# EAGLE design Yung_Chicklet (EAGLE 9.6.0)
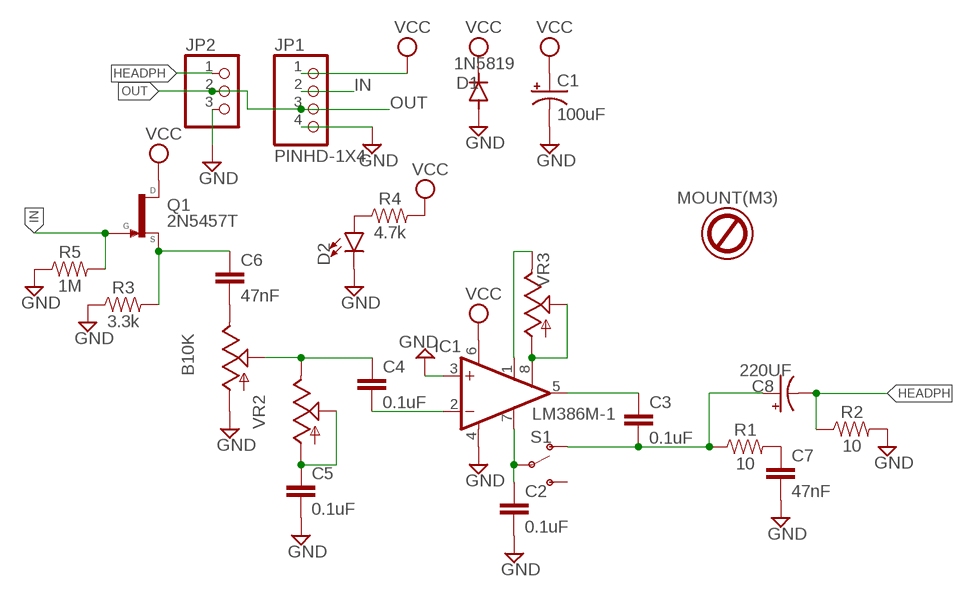
[diagram p0: schematic, sheet 1]

## Parts
B10K  9MM_SNAP-IN_POT_  [9MM_SNAP-IN_POT]
C1  100uF  CAP_SMD+THRUPAN_B  [PAN_B_SMD+THRU]
C2  0.1uF  0.1UF-0603-25V-(+80/-20%)  [0603]
C3  0.1uF  0.1UF-0603-25V-(+80/-20%)  [0603]
C4  0.1uF  0.1UF-0603-25V-(+80/-20%)  [0603]
C5  0.1uF  0.1UF-0603-25V-(+80/-20%)  [0603]
C6  47nF  47NF-0603-25V-5%  [0603]
C7  47nF  47NF-0603-25V-5%  [0603]
C8  220UF  CAP_SMD+THRUPAN_B  [PAN_B_SMD+THRU]
D1  1N5819  DIODE-SOD123  [SOD123]
D2  LED1206  [LED-1206]
IC1  LM386M-1  [SO08]
JP1  PINHD-1X4  [1X04]
JP2  PINHD-1X3  [1X03]
O2  MOUNT(M3)  [HOLE-3.5MM]
Q1  2N5457T  [TO92F]
R1  10  10OHM-0603-1/10W-1%  [0603]
R2  10  10OHM-0603-1/10W-1%  [0603]
R3  3.3k  3.3KOHM-0603-1/10W-1%  [0603]
R4  4.7k  4.7KOHM-0603-1/10W-1%  [0603]
R5  1M  1MOHM-0603-1/4W-5%  [0603]
S1  SWITCH-SPDT-PTH-11.6X4.0MM-LOCK  [SWITCH_SPDT_PTH_11.6X4.0MM_LOCK]
VR2  9MM_SNAP-IN_POT_  [9MM_SNAP-IN_POT]
VR3  9MM_SNAP-IN_POT_  [9MM_SNAP-IN_POT]

## Nets
GND: B10K.1(A) C1.- C1.--(-) C2.2 C5.2 C7.2 D1.A D2.C IC1.3(+IN) IC1.4(GND) JP1.4 JP2.3 R2.2 R3.1 R5.1
HEADPH: C8.- C8.--(-) JP2.1 R2.1
IN: JP1.2 Q1.1(G) R5.2
N$1: D2.A R4.1
N$2: C6.1 Q1.2(S) R3.2
N$3: B10K.3(E) C6.2
N$4: B10K.2(S) C4.1 VR2.3(E)
N$5: C5.1 VR2.1(A) VR2.2(S)
N$6: C4.2 IC1.2(-IN)
N$7: IC1.8(GAIN) VR3.1(A) VR3.2(S)
N$8: IC1.1(GAIN) VR3.3(E)
N$9: C3.1 IC1.5(OUT)
N$10: C2.1 IC1.7(BYPASS) S1.2(P)
N$11: C3.2 C8.+ C8.++(+) R1.1 S1.1(O)
N$12: C7.1 R1.2
OUT: JP1.3 JP2.2
VCC: C1.+ C1.++(+) D1.C IC1.6(VS) JP1.1 Q1.3(D) R4.2
Unconnected: O2.MNT S1.3(S)

## Library data of the parts
B10K VR2 VR3 = MusicThingModular:9MM_SNAP-IN_POT: 9mm vertical snap-in pot, Alpha / Panasonic style
C1 C8 = MusicThingModular:CAP_SMD+THRU
C2-C5 = SparkFun-Capacitors:0.1UF: 0.1µF ceramic capacitors A capacitor is a passive two-terminal electrical component used to store electrical energy temporarily in an electric field.; PROD_ID: CAP-00810
C6 C7 = SparkFun-Capacitors:47NF: 47nF ceramic capacitors A capacitor is a passive two-terminal electrical component used to store electrical energy temporarily in an electric field.; PROD_ID: CAP-08605
D1 = diode:DIODE-: DIODE
D2 = SparkFun-LED:LED: LED (Generic) Standard schematic elements and footprints for 5mm, 3mm, 1206, and 0603 sized LEDs. Generic LEDs with no color specified.
IC1 = linear:LM386?-*: Low Voltage Audio Power Amplifier Source: http://cache.national.com/ds/LM/LM386.pdf
JP1 = Connector:PINHD-1X4: PIN HEADER; CATEGORY: CONNECTOR; SUB-CATEGORY: PIN-HEADER
JP2 = pinhead:PINHD-1X3: PIN HEADER
O2 = hardware:MOUNT(?)
Q1 = transistors:2N5457: N-CHANNEL JFET
R1 R2 = SparkFun-Resistors:10OHM: 10Ω resistor A resistor is a passive two-terminal electrical component that implements electrical resistance as a circuit element. Resistors act to reduce current flow, and, at the same time, act to lower voltage levels within circuits. - Wikipedia; PROD_ID: RES-12581
R3 = SparkFun-Resistors:3.3KOHM: 3.3kΩ resistor A resistor is a passive two-terminal electrical component that implements electrical resistance as a circuit element. Resistors act to reduce current flow, and, at the same time, act to lower voltage levels within circuits. - Wikipedia; PROD_ID: RES-07851
R4 = SparkFun-Resistors:4.7KOHM: 4.7kΩ resistor A resistor is a passive two-terminal electrical component that implements electrical resistance as a circuit element. Resistors act to reduce current flow, and, at the same time, act to lower voltage levels within circuits. - Wikipedia; PROD_ID: RES-07857
R5 = SparkFun-Resistors:1MOHM: 1MΩ resistor A resistor is a passive two-terminal electrical component that implements electrical resistance as a circuit element. Resistors act to reduce current flow, and, at the same time, act to lower voltage levels within circuits. - Wikipedia; PROD_ID: RES-07868
S1 = SparkFun-Switches:SWITCH-SPDT: Single Pole, Double Throw (SPDT) Switch Single-pole, double-throw (SPDT) switch. Variant Overview SMD-AYZ0202 Surface Mount DPDT Switch <https://www.sparkfun.com/products/597> (COM-00597) Used on e.g. LilyPad Arduino USB - ATmega32U4 Board <https://www.sparkfun.com/products/12049> PTH-11.6X4.0MM SPDT Mini Power Switch <https://www.sparkfun.com/products/102> (COM-00102) Used on e.g. SparkFun Simon Says - Through-Hole Soldering Kit <https://www.sparkfun.com/products/10547> (KIT-10547) PTH-11.6X4.0MM-KIT KIT version of SPDT Mini Power Switch - Simplifies soldering by removing tStop of switch pins - only one side can be soldered. PTH-11.6X4.0MM-LOCK LOCK version of SPDT Mini Power Switch - Offset pins hold switch in place for easier soldering. SMD-RIGHT-ANGLE Surface Mount Right Angle Switch <https://www.sparkfun.com/products/10860> (COM-10860) Used on e.g. SparkFun ESP8266 Thing <https://www.sparkfun.com/products/13231>; PROD_ID: SWCH-08261; SF_SKU: COM-00102

## Board
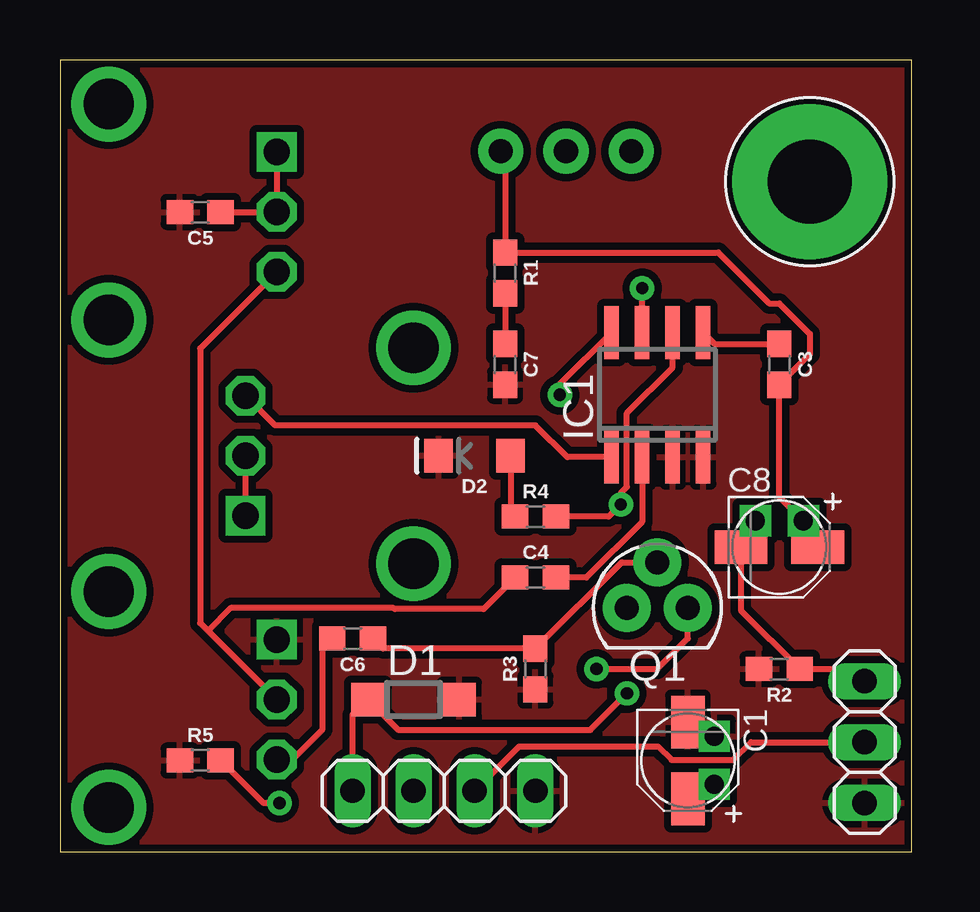
[diagram p1: board, top side]
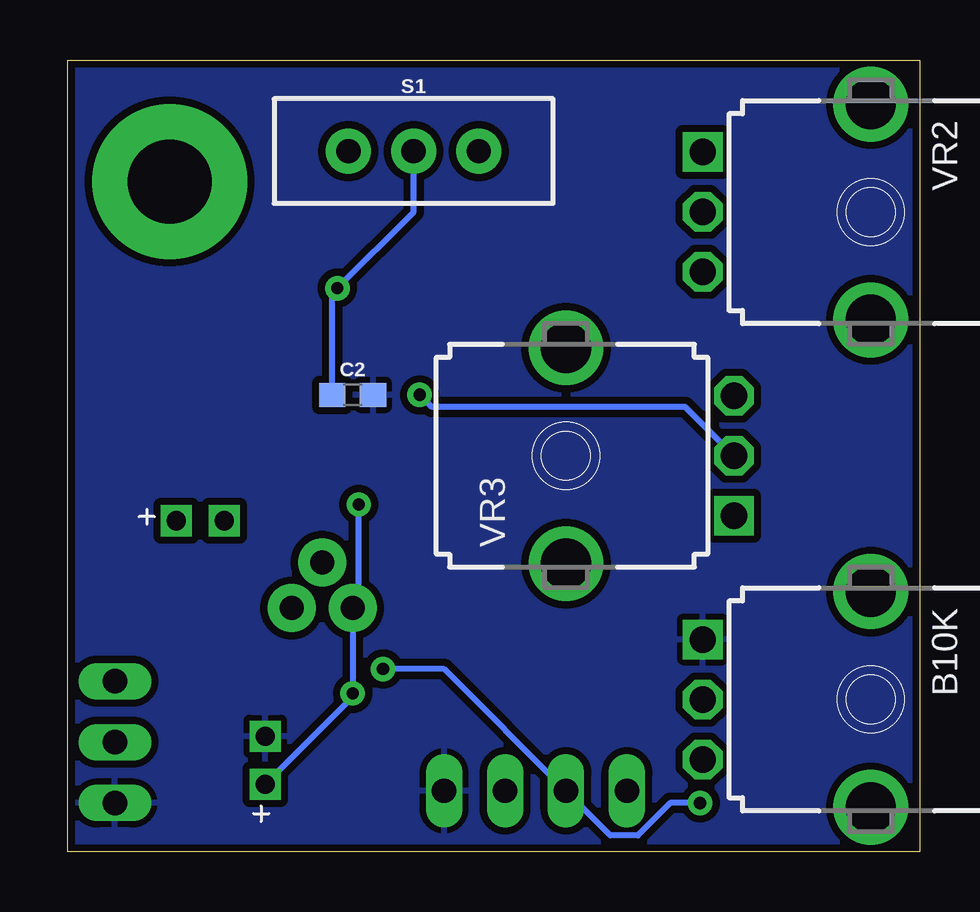
[diagram p2: board, bottom side, seen from below]

Size 35.48 x 33.01 mm. Coordinates in mm from the lower left corner, seen from the top.
Outline: 0,0 35.48,0 35.48,33.01 0,33.01 0,0
Copper layers (1*16): Top 0.035mm / dielectric 1.5mm / Bottom 0.035mm
Design rules "SparkFun-2-layer-STANDARD": minimum track width 10mil, minimum drill 20mil, track to track 10mil, track to pad 8mil, pad to pad 8mil, via to via 10mil, smd to smd 8mil, copper to edge 8mil, drill to drill 8mil, minimum pad ring 10mil, minimum via ring 10mil, stop-mask expansion 4mil, vias tented up to drill 25mil, thermal gap 10mil

### Footprints (pad centres in the part's own frame; a part is rotated, then mirrored left to right if it is on the bottom)
9MM_SNAP-IN_POT = drill 1.1 square: 1 -2.5,-7 | drill 1.1 octagon: 2 0,-7; 3 2.5,-7 | drill 2.1 pad 2.794: CHASSIS1 -4.5,0; CHASSIS2 4.5,0
PAN_B_SMD+THRU = smd 2.2 x 1.4: + 1.6,0; - -1.6,0 | drill 0.8 pad 0.9 square: ++ 1,1.1; -- -1,1.1
0603 = smd 1.1 x 1: 1 -0.85,0; 2 0.85,0
SOD123 = smd 1.4 x 1.4: A 1.9,0; C -1.9,0
LED-1206 = smd 1.2 x 1.4: A -1.5,0; C 1.5,0
SO08 = smd 0.6 x 2.2: 1 -1.905,-2.6; 2 -0.635,-2.6; 3 0.635,-2.6; 4 1.905,-2.6; 5 1.905,2.6; 6 0.635,2.6; 7 -0.635,2.6; 8 -1.905,2.6
1X04 = drill 1.016 long: 1 -3.81,0; 2 -1.27,0; 3 1.27,0; 4 3.81,0
1X03 = drill 1.016 long: 1 -2.54,0; 2 0,0; 3 2.54,0
HOLE-3.5MM = drill 3.5 pad 6.452: MNT 0,0
TO92F = drill 1 pad 2: 1 1.27,0; 2 0,1.905; 3 -1.27,0
SWITCH_SPDT_PTH_11.6X4.0MM_LOCK = drill 1.016 pad 1.88: 1 0,2.718; 2 0,0; 3 0,-2.718

### Placement (x,y rotation side)
B10K  2.03,6.35 270 bottom
C1  26.16,3.81 270 top
C2  23.62,19.05 0 bottom
C3  29.97,20.32 270 top
C4  19.81,11.43 0 top
C5  5.84,26.67 180 top
C6  12.19,8.89 180 top
C7  18.54,20.32 270 top
C8  29.97,12.7 0 top
D1  14.73,6.35 0 top
D2  17.27,16.51 180 top
IC1  24.89,19.05 0 top
JP1  16,2.54 0 top
JP2  33.53,4.57 270 top
O2  31.24,27.94 0 top
Q1  24.89,10.16 0 top
R1  18.54,24.13 270 top
R2  29.97,7.62 180 top
R3  19.81,7.62 90 top
R4  19.81,13.97 0 top
R5  5.84,3.81 0 top
S1  21.08,29.21 270 bottom
VR2  2.03,26.67 270 bottom
VR3  14.73,16.51 90 bottom

### Tracks (layer width: path | path; a pad name or v marks a point on that pad's centre or on a via)
GND
  pour Top (isolate 0.305): 0,33.02 0,0 35.56,0 35.56,33.02
  pour Bottom (isolate 0.305): 0,32.77 0,0 35.56,0 35.56,33.02 0.25,33.02
HEADPH
  Top 0.254: C8.-- 28.97,13.3 C8.- 28.37,10.07 R2.1 33.02,7.62 JP2.1
IN  (via drill 0.51)
  Top 0.254: v22.35,7.62 24.89,7.62 26.16,8.89 Q1.1 | R5.2 8.47,2.03 v9.14,2.03
  Bottom 0.254: v22.35,7.62 19.81,7.62 JP1.2 12.88,0.69 11.74,0.69 10.39,2.03 v9.14,2.03
N$1
  Top 0.254: D2.A 18.77,14.16 R4.1
N$2
  Top 0.254: Q1.2 23.41,12.06 R3.2 13.46,8.47 C6.1
N$3
  Top 0.254: C6.2 10.92,8.47 10.92,5.08 9.69,3.85 B10K.3
N$4
  Top 0.254: VR2.3 5.84,20.98 5.84,9.54 6.17,9.21 | 6.17,9.21 B10K.2 | C4.1 17.65,10.12 13.95,10.12 13.91,10.16 7.11,10.16 6.17,9.21
N$5
  Top 0.254: C5.1 VR2.2 VR2.1
N$6
  Top 0.254: IC1.2 24.26,13.76 21.93,11.43 C4.2
N$7  (via drill 0.51)
  Top 0.254: VR3.1 VR3.2 | IC1.8 20.83,19.49 v20.83,19.05
  Bottom 0.254: VR3.2 9.76,18.54 20.32,18.54 v20.83,19.05
N$8
  Top 0.254: IC1.1 21.14,16.45 19.81,17.78 8.96,17.78 VR3.3
N$9
  Top 0.254: IC1.5 27.28,21.17 C3.1
N$10  (via drill 0.51)
  Top 0.254: IC1.7 v24.26,23.5
  Bottom 0.254: S1.2 21.08,26.67 v24.26,23.5 24.47,23.28 C2.1
N$11
  Top 0.254: S1.1 18.54,29.03 R1.1 27.43,24.98 29.55,22.86 29.97,22.86 31.24,21.59 31.24,20.74 C3.2 29.97,14.8 C8.++ 30.97,13.3 C8.+
N$12
  Top 0.254: R1.2 C7.1
OUT
  Top 0.254: JP2.2 28.8,4.57 28.05,3.83 25.48,3.83 24.91,4.39 19.13,4.39 JP1.3
VCC  (via drill 0.51)
  Top 0.254: C1.++ 26.66,2.21 C1.+ | JP1.1 12.19,5.71 D1.C 14.1,5.08 22.1,5.08 v23.62,6.6 | R4.2 22.86,13.97 v23.37,14.48 23.37,14.96 23.62,15.21 23.62,18.28 25.53,20.19 IC1.6
  Bottom 0.254: C1.++ 23.75,6.32 23.75,6.48 v23.62,6.6 Q1.3 23.37,10.41 v23.37,14.48